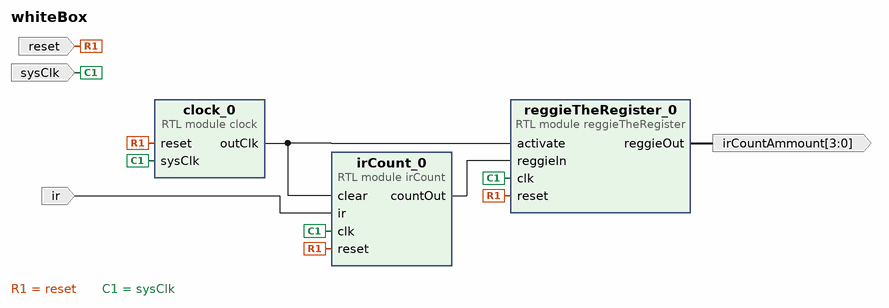
[diagram p0: block diagram of the top level]
# Vivado block design whiteBox, xc7z020clg400-1, Vivado 2022.2
create_bd_design whiteBox

create_bd_port -dir I -type data ir
create_bd_port -dir I -type rst reset
set_property -dict {CONFIG.POLARITY ACTIVE_HIGH} [get_bd_ports reset]
create_bd_port -dir O -from 3 -to 0 -type data irCountAmmount
create_bd_port -dir I sysClk

create_bd_cell -type module -reference reggieTheRegister reggieTheRegister_0
create_bd_cell -type module -reference irCount irCount_0
create_bd_cell -type module -reference clock clock_0

# ---- connections ----

connect_bd_net [get_bd_pins clock_0/outClk] [get_bd_pins reggieTheRegister_0/activate] [get_bd_pins irCount_0/clear]
connect_bd_net [get_bd_pins irCount_0/countOut] [get_bd_pins reggieTheRegister_0/reggieIn]
connect_bd_net [get_bd_ports ir] [get_bd_pins irCount_0/ir]
connect_bd_net [get_bd_pins reggieTheRegister_0/reggieOut] [get_bd_ports irCountAmmount]
connect_bd_net [get_bd_ports reset] [get_bd_pins reggieTheRegister_0/reset] [get_bd_pins irCount_0/reset] [get_bd_pins clock_0/reset]
connect_bd_net [get_bd_ports sysClk] [get_bd_pins reggieTheRegister_0/clk] [get_bd_pins irCount_0/clk] [get_bd_pins clock_0/sysClk]

validate_bd_design
save_bd_design
